# EAGLE design template (EAGLE 8.5.0)
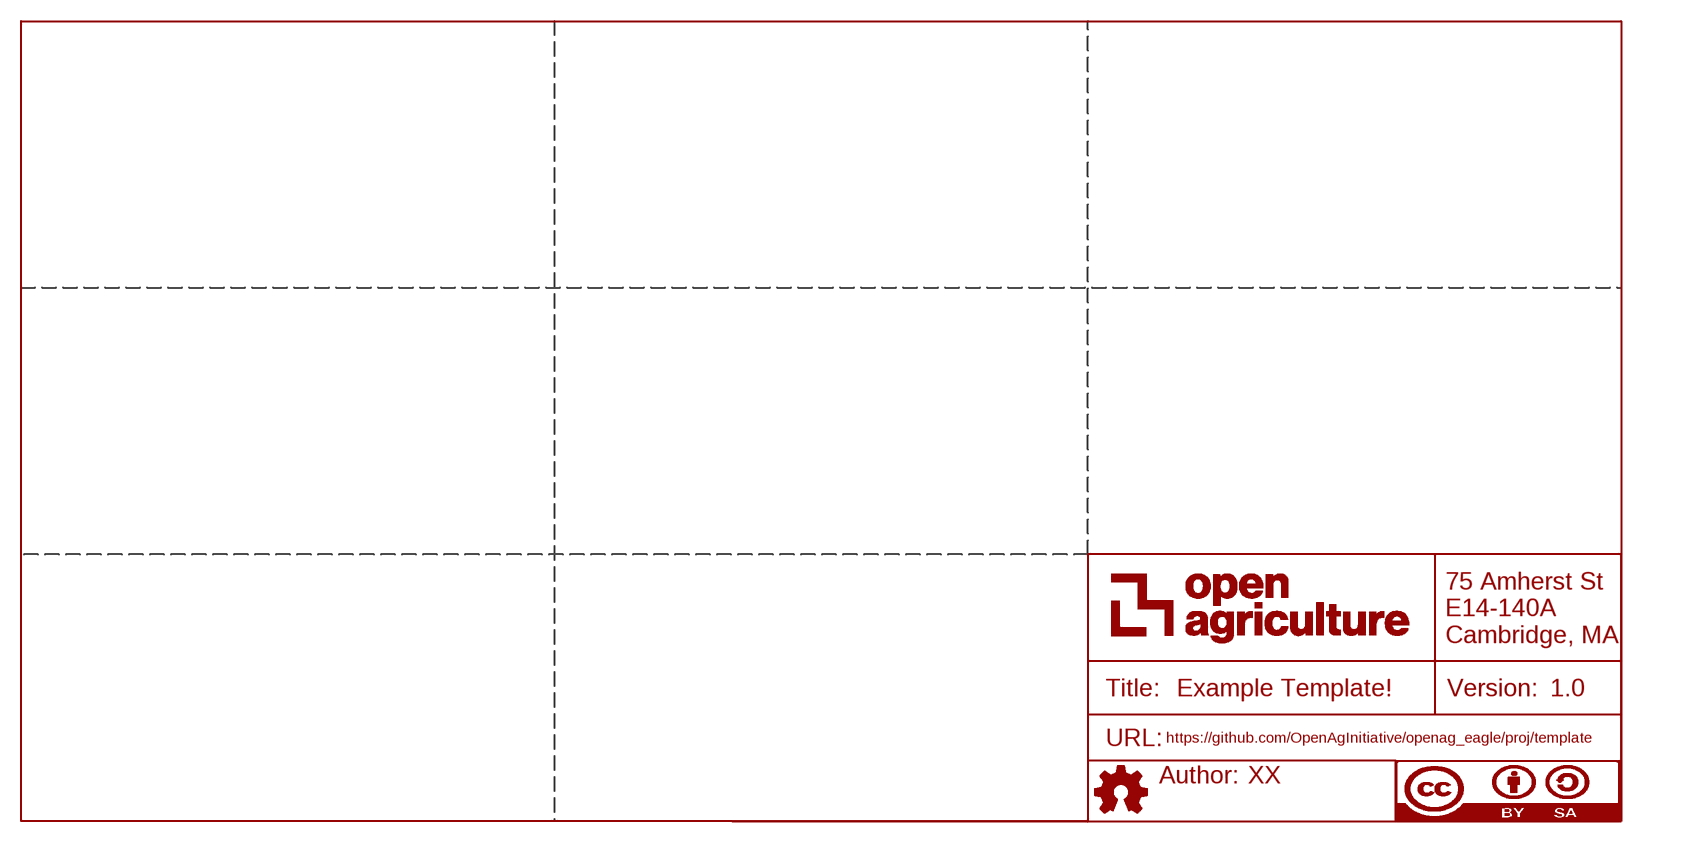
[diagram p0: schematic, sheet 1]

## Parts
FRAME1  DOCFIELD  [DOCFIELD]

## Library data of the parts
FRAME1 = openag-frames:DOCFIELD: DOCUMENT FIELD; AUTHOR: XX; DESCRIPTION: Template for starting new designs.; TITLE: Example Template!; URL: https://github.com/OpenAgInitiative/openag_eagle/proj/template; VER: 1.0

## Board
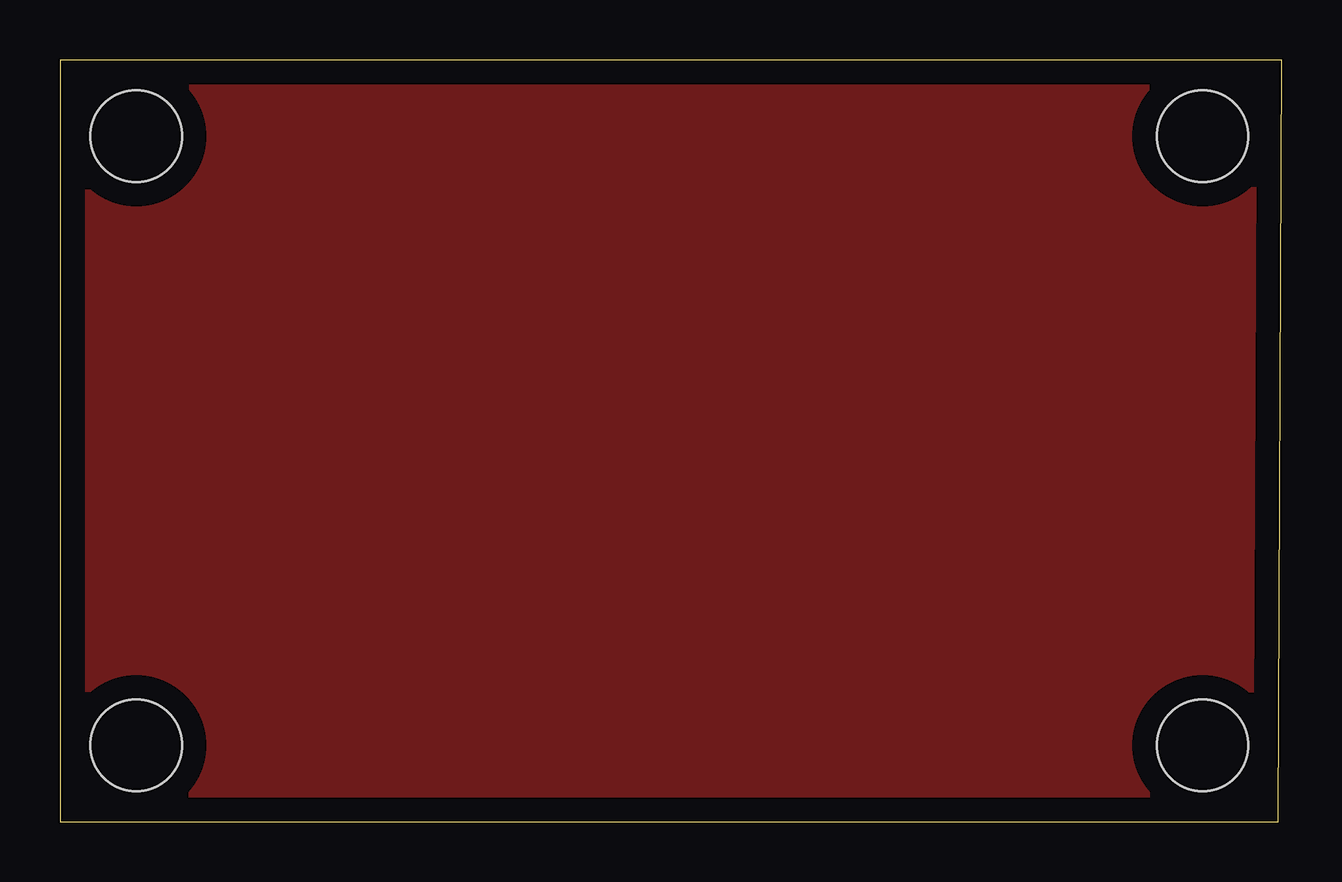
[diagram p1: board, top side]
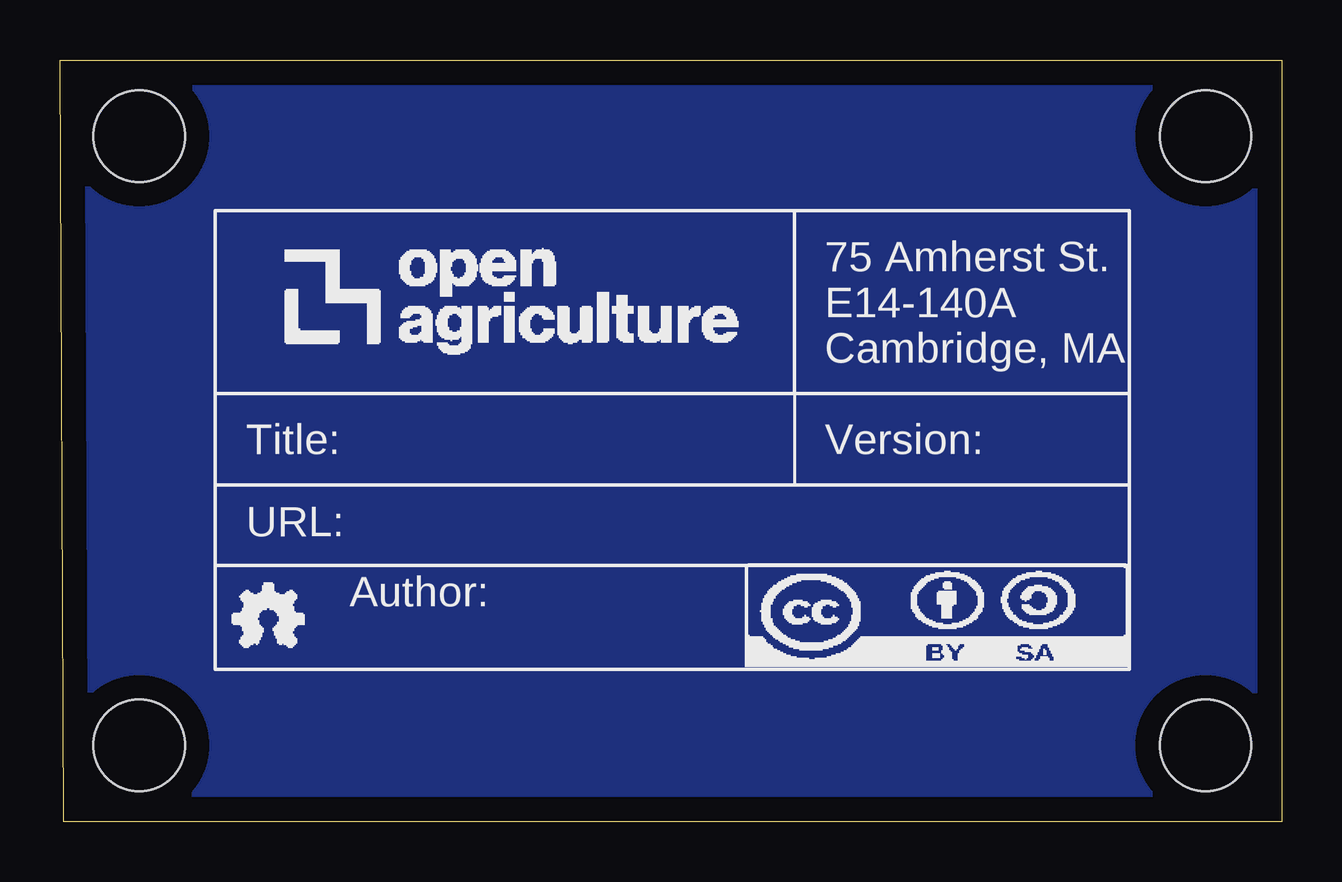
[diagram p2: board, bottom side, seen from below]

Size 50.93 x 31.75 mm. Coordinates in mm from the lower left corner, seen from the top.
Outline: 0,0 50.78,0 50.93,31.75 0,31.75 0,0
Copper layers (1*16): Top 0.035mm / dielectric 1.5mm / Bottom 0.035mm
Design rules "default": minimum track width 6mil, minimum drill 0.35mm, track to track 6mil, track to pad 6mil, pad to pad 6mil, via to via 6mil, smd to smd 6mil, copper to edge 40mil, drill to drill 6mil, minimum pad ring 10mil, minimum via ring 8mil, stop-mask expansion 4mil, vias tented up to drill 0mil, thermal gap 10mil
Holes 3.81 mm at 3.17,3.17 47.62,3.17 3.17,28.57 47.62,28.57

### Placement (x,y rotation side)
FRAME1  44.45,6.35 0 bottom

### Tracks (layer width: path | path; a pad name or v marks a point on that pad's centre or on a via)
GND
  pour Top (isolate 0.406, rank 3): 0,0 50.8,0 50.8,31.75 0,31.75
  pour Bottom (isolate 0.406, rank 3): 0,31.75 50.8,31.75 50.8,0 0,0